# EAGLE design Nano-CC-EL_0v6_ENP252-17 (EAGLE 7.3.0)
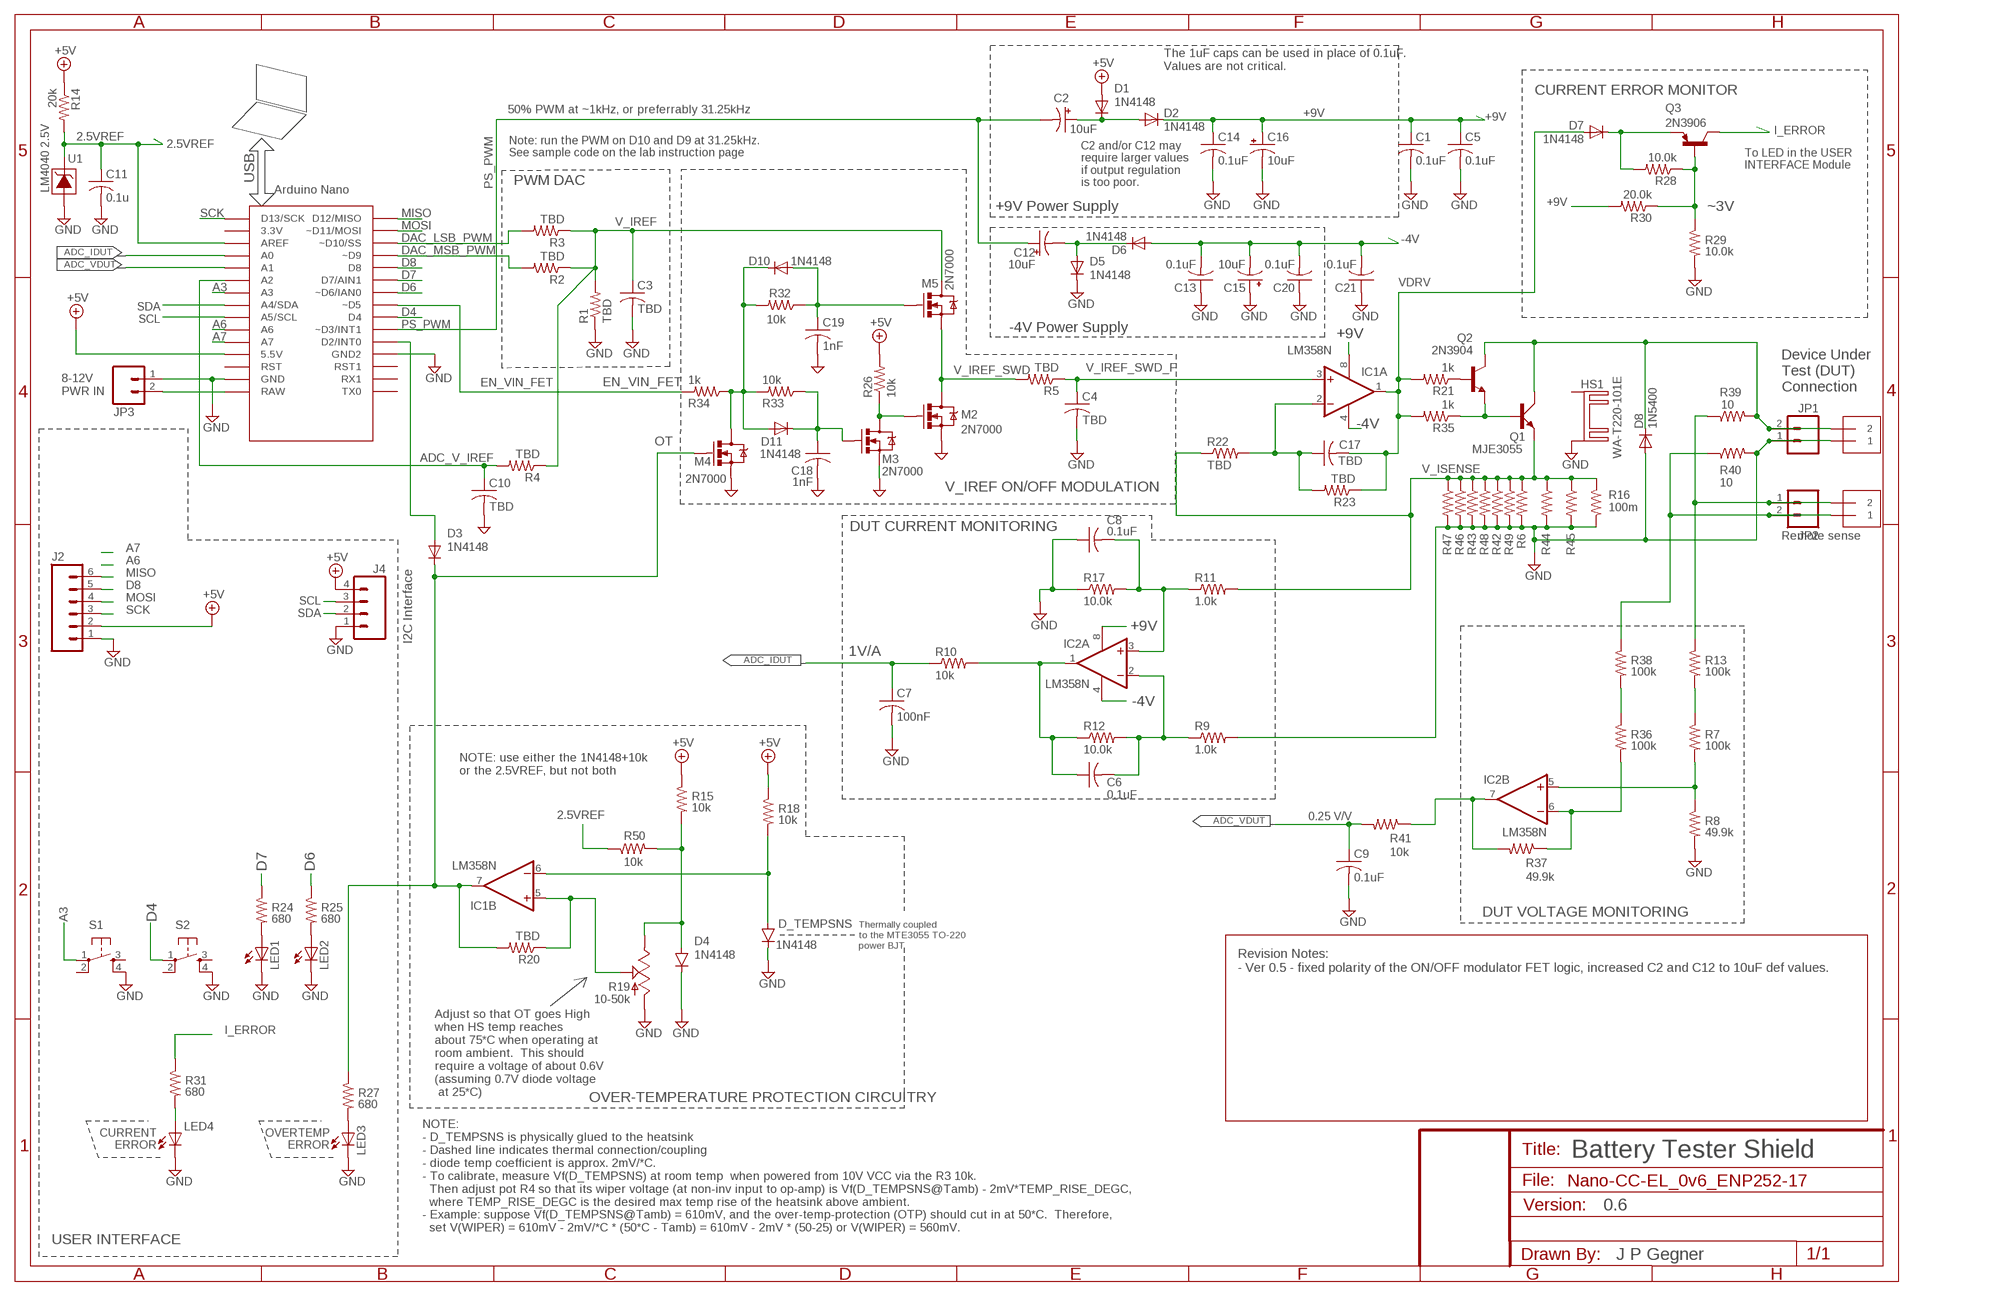
[diagram p0: schematic, sheet 1]

## Parts
C1  0.1uF  C-US025-025X050  [C025-025X050]
C2  10uF  CPOL-USE5-5  [E5-5]
C3  TBD  C-US025-025X050  [C025-025X050]
C4  TBD  C-US025-025X050  [C025-025X050]
C5  0.1uF  C-US025-025X050  [C025-025X050]
C6  0.1uF  C-US025-025X050  [C025-025X050]
C7  100nF  C-US025-024X044  [C025-024X044]
C8  0.1uF  C-US025-025X050  [C025-025X050]
C9  0.1uF  C-US025-025X050  [C025-025X050]
C10  TBD  C-US025-025X050  [C025-025X050]
C11  0.1u  C-US025-025X050  [C025-025X050]
C12  10uF  CPOL-USE5-5  [E5-5]
C13  0.1uF  C-US025-025X050  [C025-025X050]
C14  0.1uF  C-US025-025X050  [C025-025X050]
C15  10uF  CPOL-USE5-5  [E5-5]
C16  10uF  CPOL-USE5-5  [E5-5]
C17  TBD  C-US025-025X050  [C025-025X050]
C18  1nF  C-US025-025X050  [C025-025X050]
C19  1nF  C-US025-025X050  [C025-025X050]
C20  0.1uF  C-US025-025X050  [C025-025X050]
C21  0.1uF  C-US025-025X050  [C025-025X050]
D1  1N4148  [0207/2V-D]
D2  1N4148  [0207/2V-D]
D3  1N4148  [0207/2V-D]
D4  1N4148  [0207/2V-D]
D5  1N4148  [0207/2V-D]
D6  1N4148  [0207/2V-D]
D7  1N4148  [0207/2V-D]
D8  1N5400  [DO201-15]
D10  1N4148  [0207/2V-D]
D11  1N4148  [0207/2V-D]
D_TEMPSNS  1N4148  [0207/2V-D]
HS1  WA-T220-101E  [WX-T220-101E]
IC1  LM358N  [DIL08]
IC2  LM358N  [DIL08]
J2  M06POLAR  [MOLEX-1X6]
J4  M04LOCK_LONGPADS  [1X04_LOCK_LONGPADS]
JP1  M02PTH  [1X02]
JP2  M02PTH  [1X02]
JP3  M02PTH  [1X02]
JP4  1X2-3.5MM  [1X2-3.5MM]
JP5  1X2-3.5MM  [1X2-3.5MM]
LED1  LED-3MM-NO_SILK  [LED3MM-NS]
LED2  LED-3MM-NO_SILK  [LED3MM-NS]
LED3  LED-3MM-NO_SILK  [LED3MM-NS]
LED4  LED-3MM-NO_SILK  [LED3MM-NS]
M2  2N7000  MOSFET-NCHANNEL2N7000  [TO-92]
M3  2N7000  MOSFET-NCHANNEL2N7000  [TO-92]
M4  2N7000  MOSFET-NCHANNEL2N7000  [TO-92]
M5  2N7000  MOSFET-NCHANNEL2N7000  [TO-92]
Q1  MJE3055  [TO220AV]
Q2  2N3904  [TO92]
Q3  2N3906  [TO92]
R1  TBD  R-US_0204/7  [0204/7]
R2  TBD  R-US_0204/7  [0204/7]
R3  TBD  R-US_0204/7  [0204/7]
R4  TBD  R-US_0204/7  [0204/7]
R5  TBD  R-US_0204/2V  [0204V]
R6  100m  R-US_0204/7  [0204/7]
R7  100k  R-US_0204/7  [0204/7]
R8  49.9k  R-US_0204/7  [0204/7]
R9  1.0k  R-US_0204/7  [0204/7]
R10  10k  R-US_0204/7  [0204/7]
R11  1.0k  R-US_0204/7  [0204/7]
R12  10.0k  R-US_0204/2V  [0204V]
R13  100k  R-US_0204/7  [0204/7]
R14  20k  R-US_0204/7  [0204/7]
R15  10k  R-US_0204/7  [0204/7]
R16  100m  R-US_0204/7  [0204/7]
R17  10.0k  R-US_0204/7  [0204/7]
R18  10k  R-US_0204/7  [0204/7]
R19  10-50k  TRIM_US-B64Y  [B64Y]
R20  TBD  R-US_0204/7  [0204/7]
R21  1k  R-US_0204/7  [0204/7]
R22  TBD  R-US_0204/7  [0204/7]
R23  TBD  R-US_0204/2V  [0204V]
R24  680  R-US_0204/7  [0204/7]
R25  680  R-US_0204/7  [0204/7]
R26  10k  R-US_0204/7  [0204/7]
R27  680  R-US_0204/7  [0204/7]
R28  10.0k  R-US_0204/7  [0204/7]
R29  10.0k  R-US_0204/7  [0204/7]
R30  20.0k  R-US_0204/7  [0204/7]
R31  680  R-US_0204/7  [0204/7]
R32  10k  R-US_0204/7  [0204/7]
R33  10k  R-US_0204/7  [0204/7]
R34  1k  R-US_0204/2V  [0204V]
R35  1k  R-US_0204/7  [0204/7]
R36  100k  R-US_0204/7  [0204/7]
R37  49.9k  R-US_0204/2V  [0204V]
R38  100k  R-US_0204/7  [0204/7]
R39  10  R-US_0204/2V  [0204V]
R40  10  R-US_0204/2V  [0204V]
R41  10k  R-US_0204/7  [0204/7]
R42  100m  R-US_0204/7  [0204/7]
R43  100m  R-US_0204/7  [0204/7]
R44  100m  R-US_0204/7  [0204/7]
R45  100m  R-US_0204/7  [0204/7]
R46  100m  R-US_0204/7  [0204/7]
R47  100m  R-US_0204/7  [0204/7]
R48  100m  R-US_0204/7  [0204/7]
R49  100m  R-US_0204/7  [0204/7]
R50  10k  R-US_0204/7  [0204/7]
S1  E-SWITCH_TL1105L-F250-Q  [OMRON_B3F-1XX-JPGMOD]
S2  E-SWITCH_TL1105L-F250-Q  [OMRON_B3F-1XX-JPGMOD]
U1  LM4040 2.5V  LM4040TO92  [TO92]
U$1  NANO  [NANO]

## Nets
2.5VREF: C11.1 R14.2 R50.1 U1.2(CATHODE) U$1.AREF
+5V: D1.A J2.2 J4.4 R14.1 R15.1 R18.1 R26.2 U$1.5V(5.5V)
+9V: C1.1 C5.1 C14.1 C16.+ D2.K(C) IC1.8(P:V+) IC2.8(P:V+) R30.2
-4V: C13.2 C15.- C20.2 C21.2 D6.A IC1.4(P:V-) IC2.4(P:V-)
A3: S1.1(P) U$1.A3
A6: U$1.A6
A7: U$1.A7
ADC_IDUT: C7.1 R10.1 U$1.A0
ADC_V_IREF: C10.1 R4.2 U$1.A2
ADC_VDUT: C9.1 R41.2 U$1.A1
D4: S2.1(P) U$1.D4
D6: R25.1 U$1.D6(~D6/IAN0)
D7: R24.1 U$1.D7(D7/AIN1)
D8: J2.5 U$1.D8
DAC_LSB_PWM: R3.2 U$1.D10(~D10/SS)
DAC_MSB_PWM: R2.2 U$1.D9(~D9)
EN_VIN_FET: R34.2 U$1.D5(~D5)
EN_VIN_FETX: D10.K(C) D11.A M4.3(D) R32.2 R33.2 R34.1
GND: C1.2 C3.2 C4.2 C5.2 C7.2 C8.1 C9.2 C10.2 C11.2 C13.1 C14.2 C15.+ C16.- C18.2 C19.2 C20.1 C21.1 D4.K(C) D5.K(C) D8.A D_TEMPSNS.K(C) HS1.K2(K) J2.1 J4.1 JP1.1 JP3.1 JP5.1 LED1.K(C) LED2.K(C) LED3.K(C) LED4.K(C) M2.1(S) M3.1(S) M4.1(S) R1.1 R6.2 R8.2 R9.2 R16.2 R17.1 R19.A R29.2 R40.2 R42.2 R43.2 R44.2 R45.2 R46.2 R47.2 R48.2 R49.2 S1.4(S1) S2.4(S1) U1.3(ANODE) U$1.GND U$1.GND1(GND2)
I_ERROR: Q3.1(C) R31.1
MISO: J2.6 U$1.D12(D12/MISO)
MOSI: J2.4 U$1.D11(~D11/MOSI)
N$1: D4.A R15.2 R19.E R50.2
N$2: R7.1 R13.2
N$3: C8.2 IC2.3(A:+IN) R11.1 R17.2
N$4: C6.2 IC2.2(A:-IN) R9.1 R12.2
N$5: D_TEMPSNS.A IC1.6(B:-IN) R18.2
N$6: IC1.5(B:+IN) R19.S R20.1
N$8: C19.1 D10.A M5.2(G) R32.1
N$9: D7.K(C) Q3.3(E) R28.2
N$10: IC2.6(B:-IN) R36.2 R37.1
N$11: C12.- D5.A D6.K(C)
N$12: LED3.A R27.2
N$13: LED1.A R24.2
N$14: LED2.A R25.2
N$15: C6.1 IC2.1(A:OUT) R10.2 R12.1
N$16: LED4.A R31.2
N$17: Q3.2(B) R28.1 R29.1 R30.1
N$18: C2.+ D1.K(C) D2.A
N$19: IC2.5(B:+IN) R7.2 R8.1
N$20: C18.1 D11.K(C) M3.2(G) R33.1
N$21: M2.2(G) M3.3(D) R26.1
N$22: JP2.1 JP4.2 R13.1 R39.1
N$23: D3.A U$1.D2(D2/INT0)
N$24: Q2.2(B) R21.1
N$25: D8.C JP1.2 JP5.2 Q1.C Q2.1(C) R39.2
N$26: Q1.B Q2.3(E) R35.1
N$27: R36.1 R38.2
N$28: C17.1 IC1.2(A:-IN) R22.2 R23.2
N$29: JP2.2 JP4.1 R38.1 R40.1
OT: D3.K(C) IC1.7(B:OUT) M4.2(G) R20.2 R27.1
PS_PWM: C2.- C12.+ U$1.D3(~D3/INT1)
RAW: JP3.2 U$1.RAW
SCK: J2.3 U$1.D13(D13/SCK)
SCL: J4.3 U$1.A5(A5/SCL)
SDA: J4.2 U$1.A4(A4/SDA)
V_IREF: C3.1 M5.3(D) R1.2 R2.1 R3.1 R4.1
V_IREF_SWD: M2.3(D) M5.1(S) R5.2
V_IREF_SWD_F: C4.1 IC1.3(A:+IN) R5.1
V_ISENSE: Q1.E R6.1 R11.2 R16.1 R22.1 R42.1 R43.1 R44.1 R45.1 R46.1 R47.1 R48.1 R49.1
VDRV: C17.2 D7.A IC1.1(A:OUT) R21.2 R23.1 R35.2
VDUT_OP: IC2.7(B:OUT) R37.2 R41.1
Unconnected: HS1.K1(K) S1.2(P1) S1.3(S) S2.2(P1) S2.3(S) U$1.3.3V U$1.ICSP1 U$1.ICSP2 U$1.ICSP3 U$1.ICSP4 U$1.ICSP5 U$1.ICSP6 U$1.RST U$1.RST1 U$1.RX1 U$1.TX0

## Notes on the sheet
- The 1uF caps can be used in place of 0.1uF.
  Values are not critical.
- CURRENT ERROR MONITOR
- 50% PWM at ~1kHz, or preferrably 31.25kHz
- Note: run the PWM on D10 and D9 at 31.25kHz.  
  See sample code on the lab instruction page
- To LED in the USER
  INTERFACE Module
- USB | PWM DAC
- C2 and/or C12 may
  require larger values
  if output regulation
  is too poor.
- +9V Power Supply | ~3V
- -4V Power Supply
- Device Under
  Test (DUT)
  Connection
- 8-12V
  PWR IN
- V_IREF ON/OFF MODULATION
- DUT CURRENT MONITORING
- Remote sense
- I2C Interface
- 1V/A
- NOTE: use either the 1N4148+10k
  or the 2.5VREF, but not both
- 0.25 V/V
- DUT VOLTAGE MONITORING
- Thermally coupled
  to the MTE3055 TO-220 
  power BJT
- Revision Notes:
  - Ver 0.5 - fixed polarity of the ON/OFF modulator FET logic, increased C2 and C12 to 10uF def values.
- Adjust so that OT goes High
  when HS temp reaches
  about 75*C when operating at 
  room ambient.  This should
  require a voltage of about 0.6V
  (assuming 0.7V diode voltage
   at 25*C)
- OVER-TEMPERATURE PROTECTION CIRCUITRY
- CURRENT
  ERROR
- OVERTEMP
  ERROR
- Battery Tester Shield
- 0.6
- NOTE:
  - D_TEMPSNS is physically glued to the heatsink
  - Dashed line indicates thermal connection/coupling
  - diode temp coefficient is approx. 2mV/*C.
  - To calibrate, measure Vf(D_TEMPSNS) at room temp  when powered from 10V VCC via the R3 10k.
    Then adjust pot R4 so that its wiper voltage (at non-inv input to op-amp) is Vf(D_TEMPSNS@Tamb) - 2mV*TEMP_RISE_DEGC,
    where TEMP_RISE_DEGC is the desired max temp rise of the heatsink above ambient.  
  - Example: suppose Vf(D_TEMPSNS@Tamb) = 610mV, and the over-temp-protection (OTP) should cut in at 50*C.  Therefore,
    set V(WIPER) = 610mV - 2mV/*C * (50*C - Tamb) = 610mV - 2mV * (50-25) or V(WIPER) = 560mV.
- USER INTERFACE
- J P Gegner

## Library data of the parts
C1 C3-C11 C13 C14 C17-C21 = rcl:C-US: CAPACITOR, American symbol
C2 C12 C15 C16 = rcl:CPOL-US: POLARIZED CAPACITOR, American symbol
D1-D3 D5-D7 D10 D11 = JPG_17v2:1N4148
D4 D_TEMPSNS = ideal_elements:1N4148
D8 = diode:1N5400: DIODE standard rectifier, 3 A, 50 V (Motorola)
HS1 = JPG_17v2:WA-T220-101E: Ohmite W series Heatsink for TO-220, 12 degC/W natural convection at 10W WA-T220-101E WV-T220-101E see also a T247 version
IC1 IC2 = linear:LM358: OP AMP also LM158; LM258; LM2904 Source: http://cache.national.com/ds/LM/LM158.pdf
J2 = JPG_17v2:M06: Header 6 Standard 6-pin 0.1" header. Use with straight break away headers (SKU : PRT-00116), right angle break away headers (PRT-00553), swiss pins (PRT-00743), machine pins (PRT-00117), and female headers (PRT-00115). Molex polarized connector foot print use with SKU : PRT-08094 with associated crimp pins and housings. NOTES ON THE VARIANTS LOCK and LOCK_LONGPADS... This footprint was designed to help hold the alignment of a through-hole component (i.e. 6-pin header) while soldering it into place. You may notice that each hole has been shifted either up or down by 0.005 of an inch from it's more standard position (which is a perfectly straight line). This slight alteration caused the pins (the squares in the middle) to touch the edges of the holes. Because they are alternating, it causes a "brace" to hold the component in place. 0.005 has proven to be the perfect amount of "off-center" position when using our standard breakaway headers. Although looks a little odd when you look at the bare footprint, once you have a header in there, the alteration is very hard to notice. Also,if you push a header all the way into place, it is covered up entirely on the bottom side. This idea of altering the position of holes to aid alignment will be further integrated into the Sparkfun Library for other footprints. It can help hold any component with 3 or more connection pins.
J4 = JPG_17v2:M04: Header 4 Standard 4-pin 0.1" header. Use with straight break away headers (SKU : PRT-00116), right angle break away headers (PRT-00553), swiss pins (PRT-00743), machine pins (PRT-00117), and female headers (PRT-00115). Molex polarized connector foot print use with SKU : PRT-08231 with associated crimp pins and housings. 1MM SMD Version SKU: PRT-10208; PROD_ID: CONN-09696
JP1-JP3 = JPG_17v1:M02: Header 2 Standard 2-pin 0.1" header. Use with straight break away headers (SKU : PRT-00116), right angle break away headers (PRT-00553), swiss pins (PRT-00743), machine pins (PRT-00117), and female headers (PRT-00115). Molex polarized connector foot print use with SKU : PRT-08233 with associated crimp pins and housings.
JP4 JP5 = adafruit:1X2: 3.5mm Terminal block http://www.ladyada.net/library/pcb/eaglelibrary.html
LED1-LED4 = JPG_17v2:LED: LEDs Standard schematic elements and footprints for 5mm, 3mm, 1206, and 0603 sized LEDs. 5mm - Spark Fun Electronics SKU : COM-00529 (and others)
M2-M5 = SparkFun-DiscreteSemi:MOSFET-NCHANNEL: Common NMOSFET Parts MFG P/N Store ID Prod ID FDD8780 TRANS-09984 SI7820DN TRANS-11055 FDS6630A IC-08089 2N7002PW TRANS-11151 FQP30N06L COM-10213 TRANS-10060 BSS123LT1G TRANS-08345 BSS138 TRANS-00830 BS170 2N7000
Q1 = transistor-power:MJE3055: NPN TRANSISTOR
Q2 = transistor:2N3904: NPN TRANSISTOR
Q3 = transistor-pnp:2N3906: PNP Transistor
R1-R18 R20-R50 = rcl:R-US_: RESISTOR, American symbol
R19 = JPG_17v1:TRIM_US-: POTENTIOMETER
S1 S2 = ideal_elements:E-SWITCH_TL1105L-F250-Q: PC MOUNT TACTILE MOMENTARY SWITCH (LOW COST, MOUSER)
U1 = JPG_17v1:LM4040
U$1 = Arduino-clone:NANO: Arduino Nano

## Board
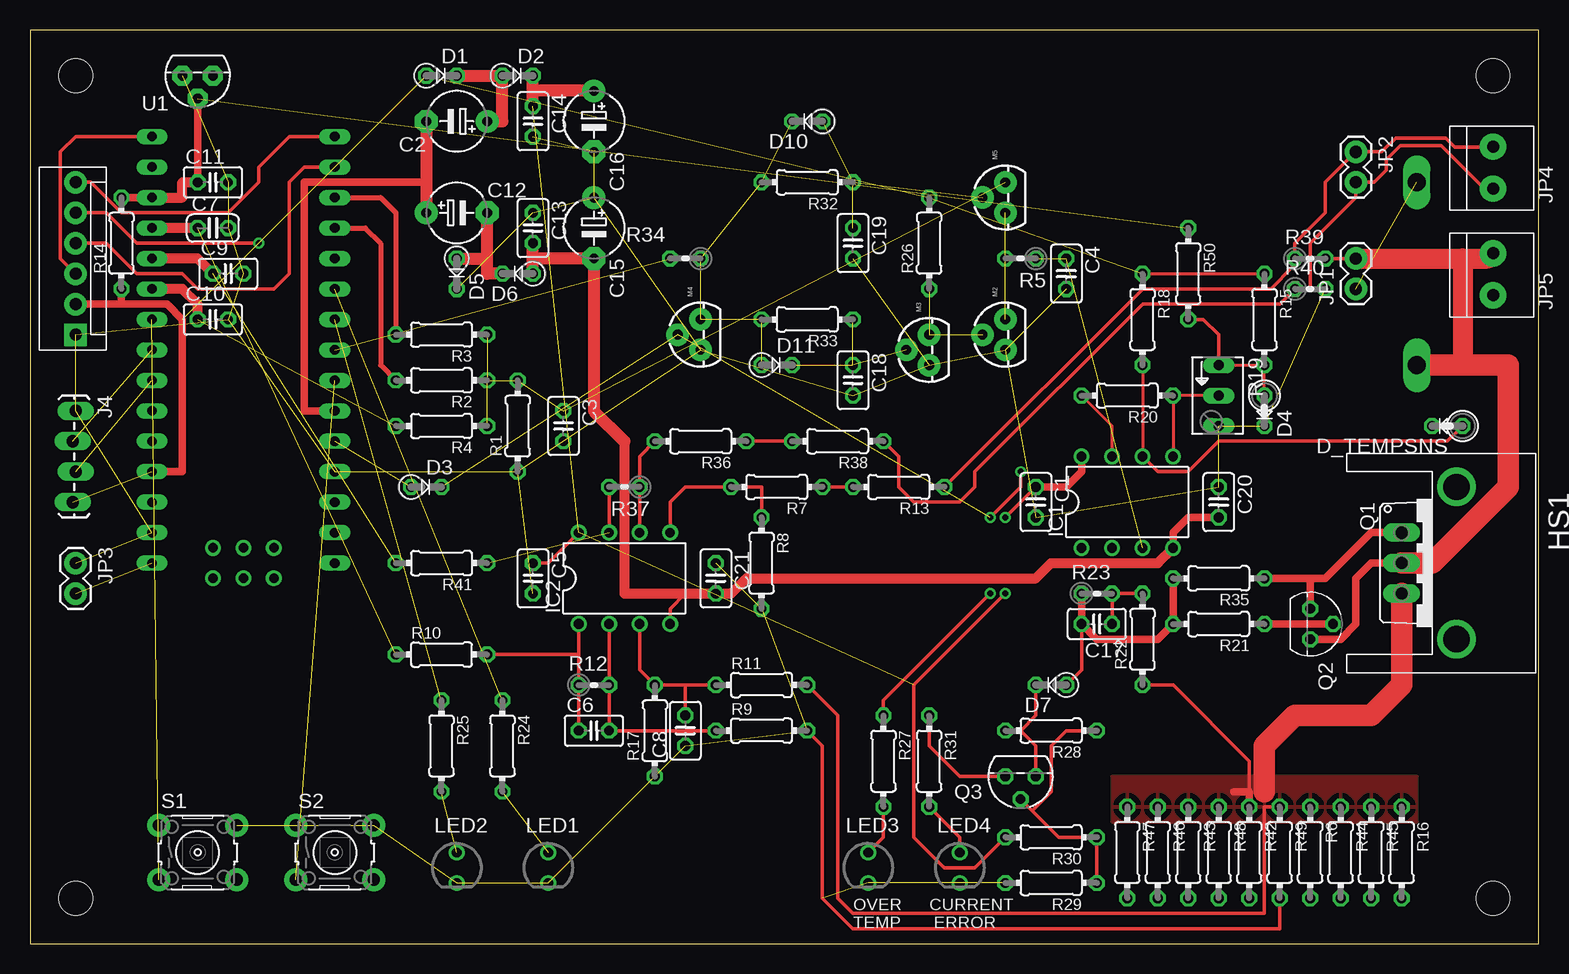
[diagram p1: board, top side]
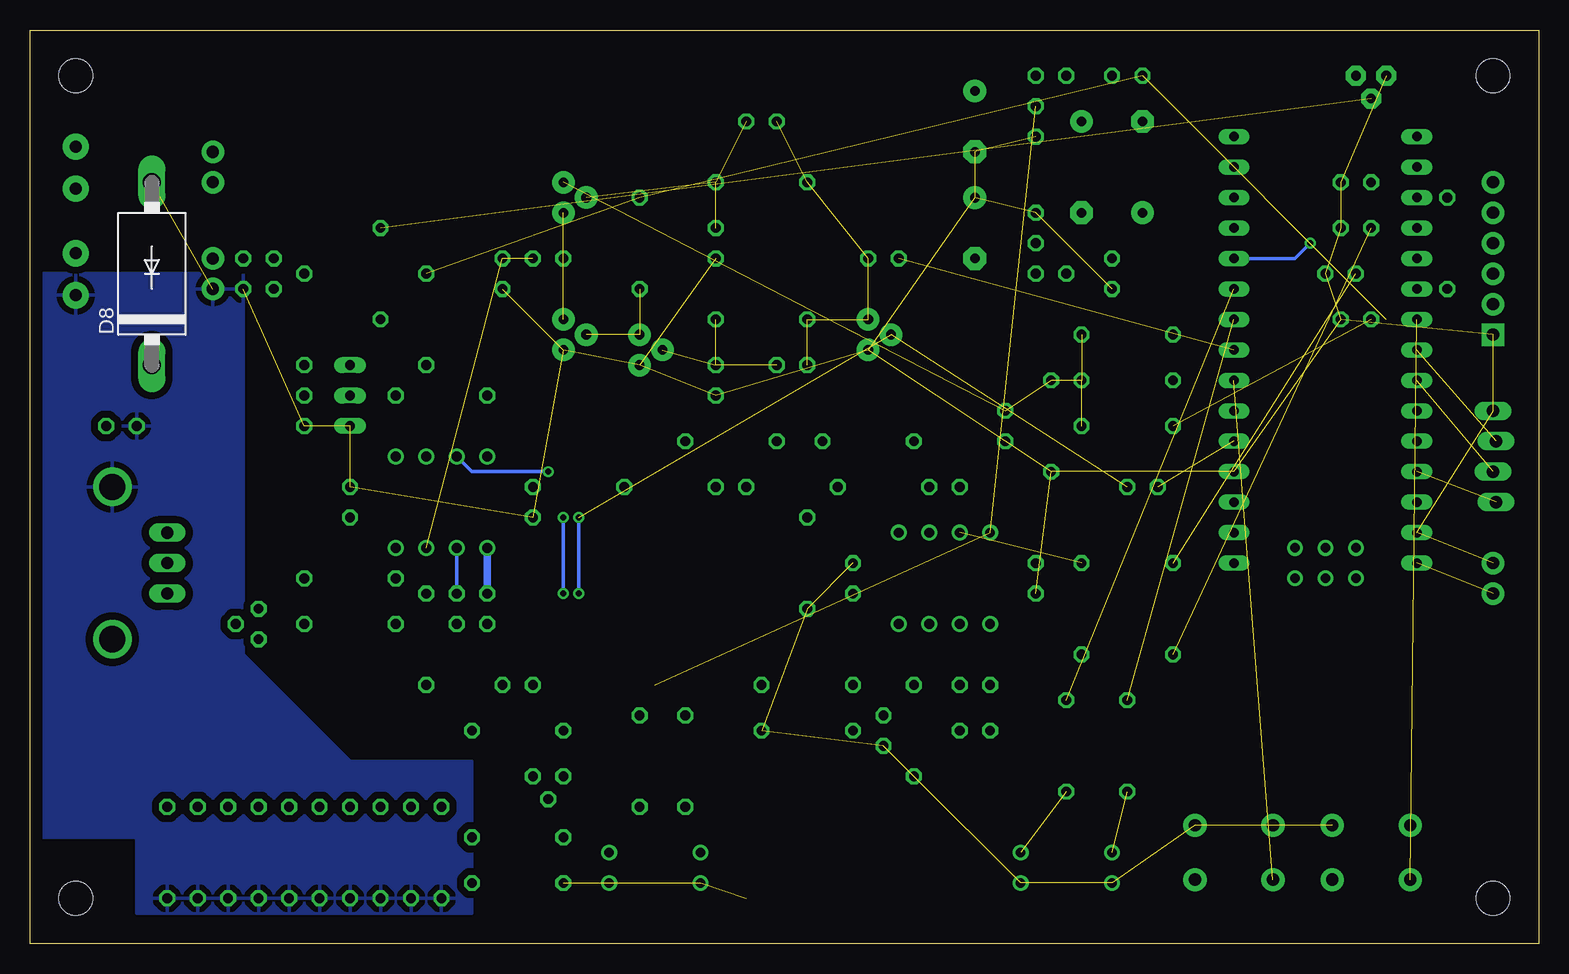
[diagram p2: board, bottom side, seen from below]

Size 125.73 x 76.2 mm. Coordinates in mm from the lower left corner, seen from the top.
Outline: 0,0 125.73,0 125.73,76.2 0,76.2 0,0
Copper layers (1*16): Top 0.035mm / dielectric 1.5mm / Bottom 0.035mm
Design rules "4pcb_$33": minimum track width 6mil, minimum drill 15mil, track to track 6mil, track to pad 6mil, pad to pad 6mil, via to via 6mil, smd to smd 6mil, copper to edge 40mil, drill to drill 6mil, minimum pad ring 10mil, minimum via ring 8mil, stop-mask expansion 4mil, vias tented up to drill 0mil, thermal gap 20mil
Holes 2.79 mm at 3.81,3.81 3.81,72.39 121.92,3.81 121.92,72.39

### Footprints (pad centres in the part's own frame; a part is rotated, then mirrored left to right if it is on the bottom)
C025-025X050 = drill 0.813 octagon: 1 -1.27,0; 2 1.27,0
E5-5 = drill 0.813 pad 1.905: + -2.54,0 | drill 0.813 pad 1.905 octagon: - 2.54,0
C025-024X044 = drill 0.813 octagon: 1 -1.27,0; 2 1.27,0
0207/2V-D = drill 0.813 octagon: A -1.27,0; K 1.27,0
DO201-15 = drill 1.499 long: A 7.62,0; C -7.62,0
WX-T220-101E = drill 2.2 pad 3.175: K1 -6.35,-4.572; K2 6.35,-4.572
DIL08 = drill 0.813 pad 1.27: 1 -3.81,-3.81; 2 -1.27,-3.81; 3 1.27,-3.81; 4 3.81,-3.81; 5 3.81,3.81; 6 1.27,3.81; 7 -1.27,3.81; 8 -3.81,3.81
MOLEX-1X6 = drill 1.016 pad 1.88 square: 1 0,0 | drill 1.016 pad 1.88: 2 2.54,0; 3 5.08,0; 4 7.62,0; 5 10.16,0; 6 12.7,0
1X04_LOCK_LONGPADS = drill 1.016 long: 1 0,0; 2 2.54,-0.254; 3 5.08,0; 4 7.62,-0.254
1X02 = drill 1.016 pad 1.88: 1 0,0; 2 2.54,0
1X2-3.5MM = drill 1 pad 2.184: 1 1.8,0; 2 -1.7,0
LED3MM-NS = drill 0.813: A -1.27,0; K 1.27,0
TO-92 = drill 0.813 pad 1.88: 1 -1.27,0; 2 0,1.905; 3 1.27,0
TO220AV = drill 1.016 long: B -2.54,-2.54; C 0,-2.54; E 2.54,-2.54
TO92 = drill 0.813 octagon: 1 1.27,0; 2 0,1.905; 3 -1.27,0
0204/7 = drill 0.813 octagon: 1 -3.81,0; 2 3.81,0
0204V = drill 0.813 octagon: 1 -1.27,0; 2 1.27,0
B64Y = drill 0.813 long: A 2.54,0; E -2.54,0; S 0,0
OMRON_B3F-1XX-JPGMOD = drill 1.016 pad 1.93: 1 -3.251,-2.261; 2 3.251,-2.261; 3 -3.251,2.261; 4 3.251,2.261
TO92' = drill 0.813 pad 1.676 octagon: 1 -1.27,0; 2 0,1.905; 3 1.27,0
NANO = drill 0.8 long: 3.3V -10.16,24.13; 5V -10.16,-1.27; A0 -10.16,19.05; A1 -10.16,16.51; A2 -10.16,13.97; A3 -10.16,11.43; A4 -10.16,8.89; A5 -10.16,6.35; A6 -10.16,3.81; A7 -10.16,1.27; AREF -10.16,21.59; D2 5.08,1.27; D3 5.08,3.81; D4 5.08,6.35; D5 5.08,8.89; D6 5.08,11.43; D7 5.08,13.97; D8 5.08,16.51; D9 5.08,19.05; D10 5.08,21.59; D11 5.08,24.13; D12 5.08,26.67; D13 -10.16,26.67; GND -10.16,-6.35; GND1 5.08,-1.27; RAW -10.16,-8.89; RST -10.16,-3.81; RST1 5.08,-3.81; RX1 5.08,-6.35; TX0 5.08,-8.89 | drill 0.8: ICSP1 -5.08,-10.16; ICSP2 -5.08,-7.62; ICSP3 -2.54,-10.16; ICSP4 -2.54,-7.62; ICSP5 0,-10.16; ICSP6 0,-7.62

### Placement (x,y rotation side)
C1  83.82,36.83 270 top
C2  35.56,68.58 180 top
C3  44.45,43.18 270 top
C4  86.36,55.88 270 top
C5  41.91,30.48 270 top
C6  46.99,17.78 0 top
C7  15.24,59.69 0 top
C8  54.61,17.78 90 top
C9  16.51,55.88 0 top
C10  15.24,52.07 0 top
C11  15.24,63.5 0 top
C12  35.56,60.96 0 top
C13  41.91,59.69 270 top
C14  41.91,68.58 270 top
C15  46.99,59.69 270 top
C16  46.99,68.58 270 top
C17  88.9,26.67 180 top
C18  68.58,46.99 270 top
C19  68.58,58.42 270 top
C20  99.06,36.83 270 top
C21  57.15,30.48 270 top
D1  34.29,72.39 0 top
D2  40.64,72.39 0 top
D3  33.02,38.1 0 top
D4  102.87,44.45 270 top
D5  35.56,55.88 270 top
D6  40.64,55.88 180 top
D7  85.09,21.59 180 top
D8  115.57,55.88 90 bottom
D10  64.77,68.58 180 top
D11  62.23,48.26 0 top
D_TEMPSNS  118.11,43.18 180 top
HS1  114.3,31.75 90 top
IC1  91.44,36.83 0 top
IC2  49.53,30.48 0 top
J2  3.81,50.8 90 top
J4  3.81,44.45 270 top
JP1  110.49,54.61 90 top
JP2  110.49,66.04 270 top
JP3  3.81,31.75 270 top
JP4  121.92,64.77 270 top
JP5  121.92,55.88 270 top
LED1  43.18,6.35 270 top
LED2  35.56,6.35 270 top
LED3  69.85,6.35 270 top
LED4  77.47,6.35 270 top
M2  81.28,50.8 90 top
M3  74.93,49.53 90 top
M4  55.88,50.8 90 top
M5  81.28,62.23 90 top
Q1  116.84,31.75 270 top
Q2  106.68,26.67 270 top
Q3  82.55,13.97 180 top
R1  40.64,43.18 90 top
R2  34.29,46.99 180 top
R3  34.29,50.8 180 top
R4  34.29,43.18 180 top
R5  82.55,57.15 180 top
R6  106.68,7.62 270 top
R7  62.23,38.1 180 top
R8  60.96,31.75 270 top
R9  60.96,17.78 0 top
R10  34.29,24.13 0 top
R11  60.96,21.59 0 top
R12  46.99,21.59 0 top
R13  72.39,38.1 180 top
R14  7.62,58.42 90 top
R15  102.87,52.07 270 top
R16  114.3,7.62 270 top
R17  52.07,17.78 90 top
R18  92.71,52.07 270 top
R19  99.06,45.72 270 top
R20  91.44,45.72 180 top
R21  99.06,26.67 180 top
R22  92.71,25.4 90 top
R23  88.9,29.21 0 top
R24  39.37,16.51 270 top
R25  34.29,16.51 270 top
R26  74.93,58.42 90 top
R27  71.12,15.24 270 top
R28  85.09,17.78 180 top
R29  85.09,5.08 180 top
R30  85.09,8.89 180 top
R31  74.93,15.24 270 top
R32  64.77,63.5 180 top
R33  64.77,52.07 180 top
R34  54.61,57.15 180 top
R35  99.06,30.48 180 top
R36  55.88,41.91 180 top
R37  49.53,38.1 180 top
R38  67.31,41.91 180 top
R39  106.68,57.15 0 top
R40  106.68,54.61 0 top
R41  34.29,31.75 180 top
R42  101.6,7.62 270 top
R43  96.52,7.62 270 top
R44  109.22,7.62 270 top
R45  111.76,7.62 270 top
R46  93.98,7.62 270 top
R47  91.44,7.62 270 top
R48  99.06,7.62 270 top
R49  104.14,7.62 270 top
R50  96.52,55.88 270 top
S1  13.97,7.62 0 top
S2  25.4,7.62 0 top
U1  LM4040 2.5V  [TO92']  13.97,72.39 180 top
U$1  20.32,40.64 0 top

### Tracks (layer width: path | path; a pad name or v marks a point on that pad's centre or on a via)
2.5VREF  (1 unrouted)
  Top 0.61: R14.2 U$1.AREF | U1.2 C11.1
  Top 0.813: C11.1 12.7,63.5 12.7,62.23 U$1.AREF
+5V  (4 unrouted)
  Top 0.254: R18.1 R15.1
  Top 0.61: J2.2 7.62,53.34 | 7.62,53.34 11.43,53.34 12.7,52.07 12.7,39.37 U$1.5V | R14.1 7.62,53.34
+9V  (via drill 0.5)  (2 unrouted)
  Top 0.305: R30.2 78.74,6.35 76.2,6.35 73.66,8.89 73.66,21.59 v81.28,29.21 | v81.28,35.56 C1.1 | C5.1 43.18,31.75 IC2.8
  Top 0.61: C1.1 86.36,38.1 87.63,39.37 IC1.8
  Top 1.016: C14.1 41.91,71.12 | 41.91,71.12 D2.K | C16.+ 41.91,71.12
  Bottom 0.305: v81.28,29.21 v81.28,35.56
-4V
  Top 0.305: IC2.4 53.34,27.94 54.61,29.21 C21.2
  Top 0.61: C20.2 96.52,35.56 95.25,34.29 IC1.4
  Top 0.813: 49.53,41.91 49.53,29.21 C21.2 58.42,29.21 59.69,30.48 83.82,30.48 85.09,31.75 93.98,31.75 IC1.4
  Top 1.016: 49.53,41.91 46.99,44.45 C15.- 41.91,57.15 | D6.A 41.91,57.15 | 41.91,57.15 C13.2
A3  (1 unrouted)
ADC_IDUT  (1 unrouted)
  Top 0.813: C7.1 U$1.A0
ADC_V_IREF  (1 unrouted)
  Top 0.813: C10.1 13.97,53.34 12.7,54.61 U$1.A2
ADC_VDUT  (1 unrouted)
  Top 0.813: C9.1 13.97,57.15 U$1.A1
D4  (1 unrouted)
D6  (1 unrouted)
D7  (1 unrouted)
D8  (via drill 0.5)
  Top 0.305: v19.05,58.42 8.89,58.42 6.35,60.96 J2.5
  Bottom 0.305: U$1.D8 20.32,57.15 v19.05,58.42
DAC_LSB_PWM
  Top 0.406: U$1.D10 29.21,62.23 30.48,60.96 R3.2
DAC_MSB_PWM
  Top 0.406: U$1.D9 27.94,59.69 29.21,58.42 29.21,48.26 R2.2
EN_VIN_FET  (1 unrouted)
EN_VIN_FETX  (5 unrouted)
GND  (40 unrouted)
  Top 0.305: R9.2 66.04,16.51 66.04,3.81 68.58,1.27 104.14,1.27 R49.2
  pour Bottom (isolate 0.61, rank 2): 125.73,55.88 107.95,55.88 107.95,24.13 99.06,15.24 88.9,15.24 88.9,2.54 116.84,2.54 116.84,8.89 125.73,8.89
I_ERROR
  Top 0.305: R31.1 74.93,16.51 77.47,13.97 Q3.1
MISO
  Top 0.305: J2.6 5.08,63.5 7.62,60.96 16.51,60.96 19.05,63.5 19.05,64.77 21.59,67.31 U$1.D12
MOSI
  Top 0.305: U$1.D11 22.86,64.77 21.59,63.5 21.59,55.88 20.32,54.61 13.97,54.61 12.7,55.88 8.89,55.88 6.35,58.42 J2.4
N$1
  Top 0.254: D4.A R15.2 R19.E
  Top 0.305: R50.2 97.79,52.07 99.06,50.8 R19.E
N$2
  Top 0.305: R7.1 R13.2
N$3
  Top 0.305: IC2.3 50.8,22.86 R17.2 54.61,21.59 | R11.1 54.61,21.59 | C8.2 54.61,21.59
N$4
  Top 0.305: IC2.2 R12.2 C6.2 R9.1
N$5
  Top 0.254: R18.2 IC1.6
  Top 0.305: D_TEMPSNS.A 118.11,41.91 99.06,41.91 96.52,39.37 93.98,39.37 IC1.6
N$6
  Top 0.254: IC1.5 R20.1 R19.S
N$8  (3 unrouted)
N$9
  Top 0.305: Q3.3 83.82,16.51 82.55,17.78 | 82.55,17.78 R28.2 | D7.K 83.82,19.05 82.55,17.78
N$10
  Top 0.305: IC2.6 R37.1 50.8,40.64 R36.2
N$11
  Top 1.016: D6.K 38.1,55.88 38.1,57.15 | 38.1,57.15 C12.- | D5.A 38.1,57.15
N$12
  Top 0.305: R27.2 71.12,8.89 LED3.A
N$13  (1 unrouted)
N$14  (1 unrouted)
N$15
  Top 0.305: C6.1 R12.1 45.72,24.13 | 45.72,24.13 IC2.1 | R10.2 45.72,24.13
N$16
  Top 0.305: R31.2 77.47,8.89 LED4.A
N$17
  Top 0.305: R29.1 R30.1 85.72,8.89 83.5,11.11 | 83.5,11.11 Q3.2 | R28.1 86.36,17.78 85.09,16.51 85.09,12.7 83.5,11.11
N$18
  Top 1.016: C2.+ 39.37,68.58 D2.A D1.K
N$19
  Top 0.305: IC2.5 53.34,36.83 54.61,38.1 R7.2 60.96,38.1 R8.1
N$20  (3 unrouted)
N$21  (2 unrouted)
N$22
  Top 0.305: JP4.2 121.87,66.42 118.75,66.42 117.98,67.18 113.79,67.18 112.65,66.04 JP2.1 107.95,63.5 107.95,60.96 105.41,58.42 R39.1 105.28,57.02 105.28,56.52 103.38,54.61 92.71,54.61 R13.1
N$23  (1 unrouted)
N$24
  Top 0.61: R21.1 Q2.2
N$25
  Top 0.305: R39.2 JP1.2
  Top 0.61: Q2.1 109.22,25.4 110.49,26.67 110.49,30.48 111.76,31.75 Q1.C
  Top 1.676: JP1.2 119.38,57.15 | 119.38,57.15 121.49,57.15 JP5.2 | 119.38,57.15 119.38,48.26
  Top 1.778: Q1.C 116.84,31.75 123.19,38.1 123.19,48.26 119.38,48.26 D8.C | 122,57.66 JP5.2
N$26
  Top 0.61: Q1.B 111.76,34.29 107.95,30.48 106.68,30.48 | 106.68,30.48 R35.1 | Q2.3 106.68,30.48
N$27
  Top 0.305: R36.1 R38.2
N$28
  Top 0.305: C17.1 R23.2 R22.2
  Bottom 0.305: IC1.2 R23.2
N$29
  Top 0.305: JP4.1 121.18,62.97 117.6,66.55 114.17,66.55 113.03,65.41 113.03,64.52 112.01,63.5 JP2.2 110.49,62.23 106.68,58.42 106.68,54.61 R40.1 104.14,53.34 92.71,53.34 78.74,39.37 78.74,38.1 77.47,36.83 73.66,36.83 72.39,38.1 72.39,40.64 R38.1
OT  (via drill 0.5)  (2 unrouted)
  Top 0.254: IC1.7 90.17,43.18 R20.2
  Top 0.305: R27.1 71.12,20.32 v80.01,29.21 | v80.01,35.56 82.55,38.1 v82.55,39.37
  Bottom 0.305: v80.01,29.21 v80.01,35.56 | v82.55,39.37 88.9,39.37 IC1.7
PS_PWM
  Top 0.61: 33.02,63.5 22.86,63.5 22.86,44.45 U$1.D3
  Top 1.016: C2.- 33.02,63.5 C12.+
RAW  (1 unrouted)
SCK
  Top 0.305: U$1.D13 3.81,67.31 2.54,66.04 2.54,57.15 J2.3
SCL  (1 unrouted)
SDA  (1 unrouted)
V_IREF  (5 unrouted)
V_IREF_SWD  (2 unrouted)
V_IREF_SWD_F  (2 unrouted)
V_ISENSE
  Top 0.305: R11.2 67.31,19.05 67.31,3.81 68.58,2.54 102.87,2.54 102.87,11.43 R49.1 | R22.1 95.25,21.59 101.6,15.24 101.6,12.7
  Top 0.61: 100.33,12.7 101.6,12.7 R42.1
  Top 1.778: 102.87,12.7 102.87,16.51 105.41,19.05 111.76,19.05 114.3,21.59 Q1.E
  pour Top: 90.17,10.16 115.57,10.16 115.57,13.97 90.17,13.97
VDRV
  Top 0.305: D7.A 87.63,22.86 C17.2
  Top 0.61: R23.1 C17.2 88.9,25.4 93.98,25.4 R21.2 R35.2
  Bottom 0.61: IC1.1 R23.1
VDUT_OP  (1 unrouted)
  Top 0.305: R37.2 IC2.7

### Text on the board
tNames: OVER / TEMP | CURRENT / ERROR